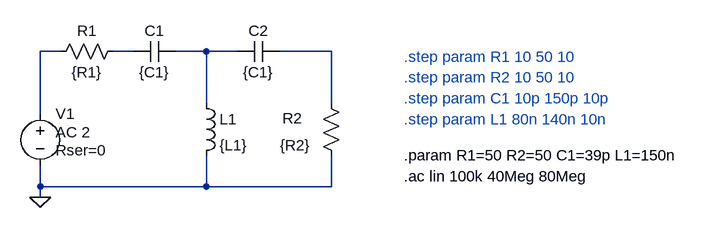
[diagram p0: schematic HighPass3.asc]
HighPass3.asc, the LTspice schematic file:
Version 4
SHEET 1 880 680
WIRE -736 -336 -768 -336
WIRE -624 -336 -656 -336
WIRE -512 -336 -560 -336
WIRE -464 -336 -512 -336
WIRE -320 -336 -400 -336
WIRE -512 -256 -512 -336
WIRE -320 -256 -320 -336
WIRE -768 -240 -768 -336
WIRE -768 -128 -768 -160
WIRE -512 -128 -512 -176
WIRE -512 -128 -768 -128
WIRE -320 -128 -320 -176
WIRE -320 -128 -512 -128
WIRE -768 -112 -768 -128
FLAG -768 -112 0
SYMBOL ind -528 -272 R0
SYMATTR InstName L1
SYMATTR Value {L1}
SYMBOL voltage -768 -256 R0
WINDOW 3 24 44 Left 2
WINDOW 123 24 44 Left 2
WINDOW 39 24 72 Left 2
SYMATTR Value ""
SYMATTR Value2 AC 2
SYMATTR SpiceLine Rser=0
SYMATTR InstName V1
SYMBOL cap -560 -352 R90
WINDOW 0 0 32 VBottom 2
WINDOW 3 32 32 VTop 2
SYMATTR InstName C1
SYMATTR Value {C1}
SYMBOL res -752 -320 R270
WINDOW 0 32 56 VTop 2
WINDOW 3 0 56 VBottom 2
SYMATTR InstName R1
SYMATTR Value {R1}
SYMBOL res -336 -272 R0
WINDOW 0 -59 39 Left 2
WINDOW 3 -63 80 Left 2
SYMATTR InstName R2
SYMATTR Value {R2}
SYMBOL cap -400 -352 R90
WINDOW 0 0 32 VBottom 2
WINDOW 3 32 32 VTop 2
SYMATTR InstName C2
SYMATTR Value {C1}
TEXT -208 -144 Left 2 !.ac lin 100k 40Meg 80Meg
TEXT -208 -232 Left 2 ;.step param L1 80n 140n 10n
TEXT -208 -264 Left 2 ;.step param C1 10p 150p 10p
TEXT -208 -176 Left 2 !.param R1=50 R2=50 C1=39p L1=150n
TEXT -208 -328 Left 2 ;.step param R1 10 50 10
TEXT -208 -296 Left 2 ;.step param R2 10 50 10

The netlist it stands for:
* HighPass3.asc
L1 N003 0 {L1}
V1 N001 0 AC 2 Rser=0
C1 N003 N002 {C1}
R1 N001 N002 {R1}
R2 N004 0 {R2}
C2 N004 N003 {C1}
.ac lin 100k 40Meg 80Meg
* .step param L1 80n 140n 10n
* .step param C1 10p 150p 10p
.param R1=50 R2=50 C1=39p L1=150n
* .step param R1 10 50 10
* .step param R2 10 50 10
.backanno
.end